# EAGLE design rcstick-f-small (EAGLE 9.5.2)
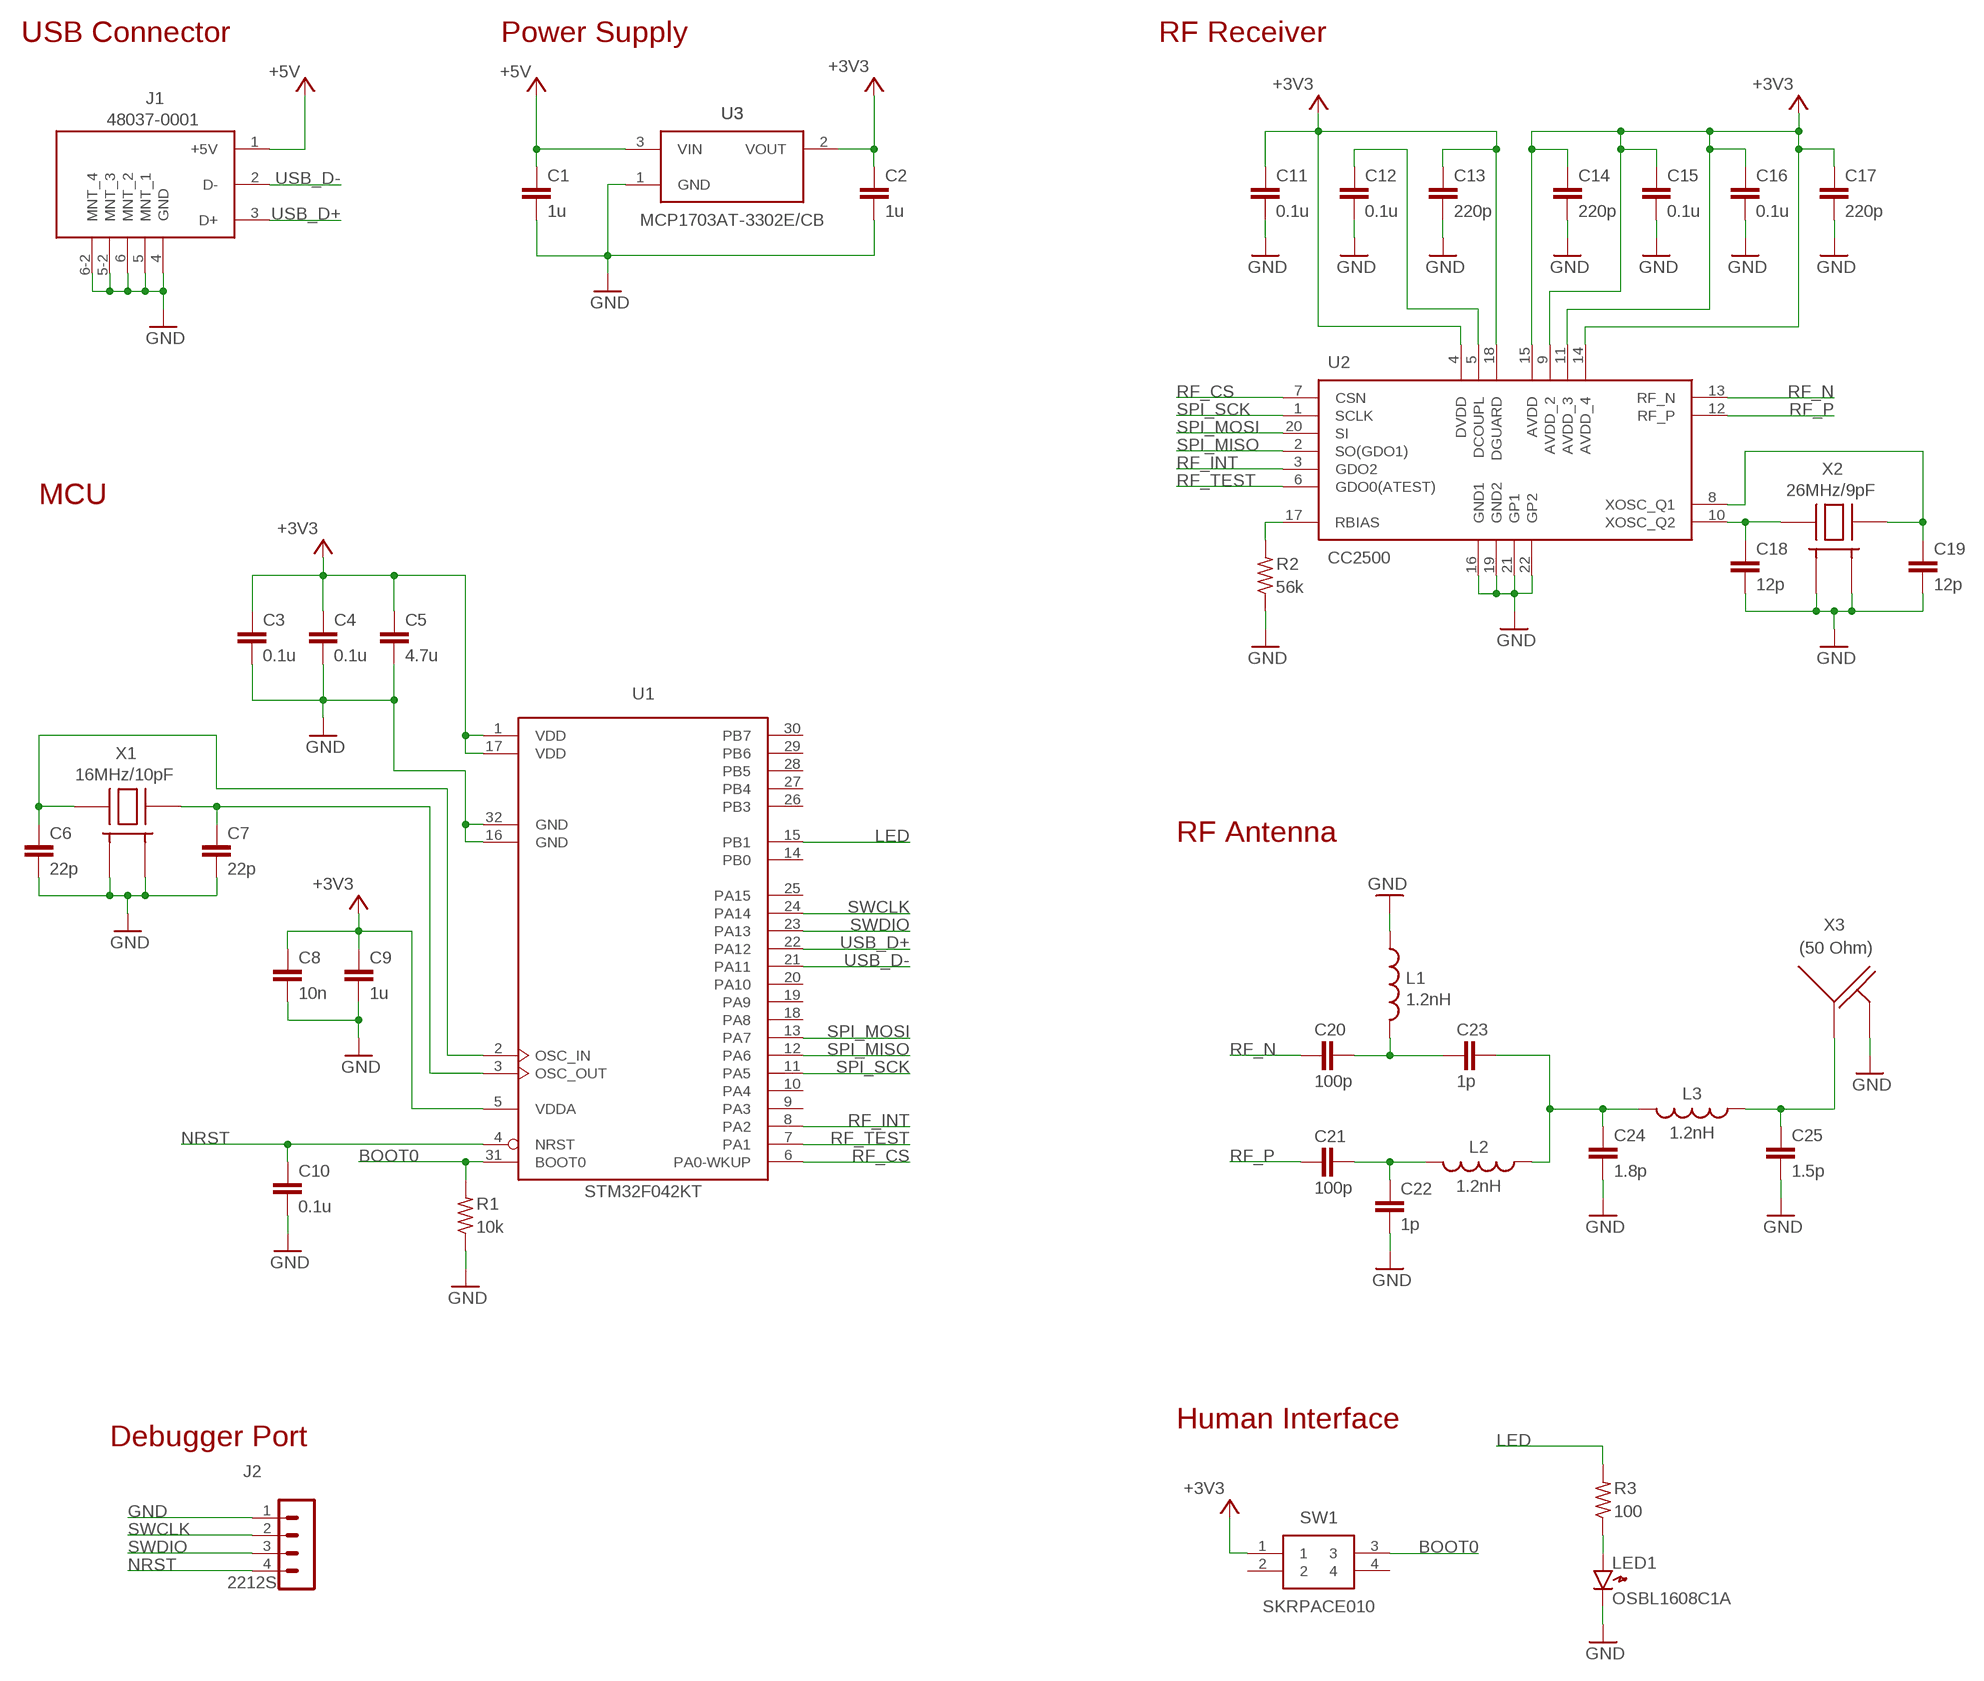
[diagram p0: schematic, sheet 1]

## Parts
C1  1u  RCL_C-EUC0402-HS  [RCL_C0402_HS]
C2  1u  RCL_C-EUC0402-HS  [RCL_C0402_HS]
C3  0.1u  RCL_C-EUC0402-HS  [RCL_C0402_HS]
C4  0.1u  RCL_C-EUC0402-HS  [RCL_C0402_HS]
C5  4.7u  RCL_C-EUC0402-HS  [RCL_C0402_HS]
C6  22p  RCL_C-EUC0402-HS  [RCL_C0402_HS]
C7  22p  RCL_C-EUC0402-HS  [RCL_C0402_HS]
C8  10n  RCL_C-EUC0402-HS  [RCL_C0402_HS]
C9  1u  RCL_C-EUC0402-HS  [RCL_C0402_HS]
C10  0.1u  RCL_C-EUC0402-HS  [RCL_C0402_HS]
C11  0.1u  RCL_C-EUC0402-HS  [RCL_C0402_HS]
C12  0.1u  RCL_C-EUC0402-HS  [RCL_C0402_HS]
C13  220p  RCL_C-EUC0402-HS  [RCL_C0402_HS]
C14  220p  RCL_C-EUC0402-HS  [RCL_C0402_HS]
C15  0.1u  RCL_C-EUC0402-HS  [RCL_C0402_HS]
C16  0.1u  RCL_C-EUC0402-HS  [RCL_C0402_HS]
C17  220p  RCL_C-EUC0402-HS  [RCL_C0402_HS]
C18  12p  RCL_C-EUC0402-HS  [RCL_C0402_HS]
C19  12p  RCL_C-EUC0402-HS  [RCL_C0402_HS]
C20  100p  RCL_C-EUC0402-HS  [RCL_C0402_HS]
C21  100p  RCL_C-EUC0402-HS  [RCL_C0402_HS]
C22  1p  RCL_C-EUC0402-HS  [RCL_C0402_HS]
C23  1p  RCL_C-EUC0402-HS  [RCL_C0402_HS]
C24  1.8p  RCL_C-EUC0402-HS  [RCL_C0402_HS]
C25  1.5p  RCL_C-EUC0402-HS  [RCL_C0402_HS]
J1  MOLEX_48037-0001  [MOLEX_48037-0001_1]
J2  2212S  53047-0410  [53047-0410]
L1  1.2nH  RCL_L-USL0402-HS  [RCL_L0402_HS]
L2  1.2nH  RCL_L-USL0402-HS  [RCL_L0402_HS]
L3  1.2nH  RCL_L-USL0402-HS  [RCL_L0402_HS]
LED1  OSBL1608C1A  LED1608  [LED1608]
R1  10k  RCL_R-US_R0402-HS  [RCL_R0402_HS]
R2  56k  RCL_R-US_R0402-HS  [RCL_R0402_HS]
R3  100  RCL_R-US_R0402-HS  [RCL_R0402_HS]
SW1  SKRPACE010  [SMT(4.2X3.2)]
U1  STM32F042KT  [LQFP32-M]
U2  CC2500  CC2500-HS  [CC2500-RTY1_CC2500-HS]
U3  MCP1703AT-3302E/CB  LDO-REGULATOR  [SOT23]
X1  16MHz/10pF  CRYSTAL3225HS  [CRYSTAL3225-HS]
X2  26MHz/9pF  CRYSTAL3225HS  [CRYSTAL3225-HS]
X3  (50 Ohm)  2.4GHZ-INVERED-FSMALL-FLIP  [2.4GHZ-INVERTED-F-SMALL-FLIP]

## Nets
+3V3 [pwr]: C2.1 C3.1 C4.1 C5.1 C8.1 C9.1 C11.1 C13.1 C14.1 C15.1 C16.1 C17.1 SW1.1 U1.1(VDD) U1.5(VDDA) U1.17(VDD) U2.4(DVDD) U2.9(AVDD_2) U2.11(AVDD_3) U2.14(AVDD_4) U2.15(AVDD) U2.18(DGUARD) U3.2(VOUT)
+5V [pwr]: C1.1 J1.1(+5V) U3.3(VIN)
BOOT0: R1.2 SW1.3 U1.31(BOOT0)
DCOUPL: C12.1 U2.5(DCOUPL)
GND [gnd]: C1.2 C2.2 C3.2 C4.2 C5.2 C6.2 C7.2 C8.2 C9.2 C10.2 C11.2 C12.2 C13.2 C14.2 C15.2 C16.2 C17.2 C18.2 C19.2 C22.2 C24.2 C25.2 J1.4(GND) J1.5(MNT_1) J1.5-2(MNT_3) J1.6(MNT_2) J1.6-2(MNT_4) J2.1 L1.1 LED1.K R1.1 R2.1 U1.16(GND) U1.32(GND) U2.16(GND1) U2.19(GND2) U2.21(GP1) U2.22(GP2) U3.1(GND) X1.2(GND_1) X1.4(GND_2) X2.2(GND_1) X2.4(GND_2) X3.2(GND)
LED: R3.2 U1.15(PB1)
N$1: LED1.A R3.1
N$5: C20.2 C23.1 L1.2
N$9: C21.2 C22.1 L2.2
N$10: C23.2 C24.1 L2.1 L3.2
N$11: C25.1 L3.1 X3.1(ANT)
NRST: C10.1 J2.4 U1.4(NRST)
OSC_IN: C6.1 U1.2(OSC_IN) X1.1(HOT_1)
OSC_OUT: C7.1 U1.3(OSC_OUT) X1.3(HOT_2)
RBIAS: R2.2 U2.17(RBIAS)
RF_CS: U1.6(PA0-WKUP) U2.7(CSN)
RF_INT: U1.8(PA2) U2.3(GDO2)
RF_N: C20.1 U2.13(RF_N)
RF_P: C21.1 U2.12(RF_P)
RF_TEST: U1.7(PA1) U2.6(GDO0(ATEST))
SPI_MISO: U1.12(PA6) U2.2(SO(GDO1))
SPI_MOSI: U1.13(PA7) U2.20(SI)
SPI_SCK: U1.11(PA5) U2.1(SCLK)
SWCLK: J2.2 U1.24(PA14)
SWDIO: J2.3 U1.23(PA13)
USB_D+: J1.3(D+) U1.22(PA12)
USB_D-: J1.2(D-) U1.21(PA11)
XOSC1: C19.1 U2.8(XOSC_Q1) X2.3(HOT_2)
XOSC2: C18.1 U2.10(XOSC_Q2) X2.1(HOT_1)
Unconnected: SW1.2 SW1.4 U1.9(PA3) U1.10(PA4) U1.14(PB0) U1.18(PA8) U1.19(PA9) U1.20(PA10) U1.25(PA15) U1.26(PB3) U1.27(PB4) U1.28(PB5) U1.29(PB6) U1.30(PB7)

## Notes on the sheet
- USB Connector | Power Supply | RF Receiver
- MCU
- RF Antenna
- Human Interface
- Debugger Port

## Library data of the parts
C1-C25 = gen-discrete3:RCL_C-EU: CAPACITOR, European symbol
J1 = Molex-48037-0001:MOLEX_48037-0001: Universal Serial Bus (USB) Shielded I/O Plug, Type A, Right Angle, Through Hole, 0.76µm Gold (Au) Plating, PCB Thickness 1.20mm-1.60mm, Lead-Free
J2 = connector:53047-0410: HEADER
L1-L3 = gen-discrete3:RCL_L-US: INDUCTOR, American symbol
LED1 = gen-discrete:LED: Generic LEDs
R1-R3 = gen-discrete3:RCL_R-US_: RESISTOR, American symbol
SW1 = SKRPACE010:SKRPACE010: Tactile Switches 4.2x3.2x2.5mm 260gf Source: Datasheet <http://www.alps.com/prod/info/E/HTML/Tact/SurfaceMount/SKRP/SKRPACE010.html>; ARROW_PART_NUMBER: SKRPACE010; DESCRIPTION: Tactile Switches 4.2x3.2x2.5mm 260gf; HEIGHT: mm; MANUFACTURER_NAME: ALPS; MANUFACTURER_PART_NUMBER: SKRPACE010
U1 = stm32:STM32F042K*T
U2 = CC2500:CC2500: RF Transceiver Source: Datasheet
U3 = SOT23_Module:LDO-REGULATOR
X1 X2 = CRYSTAL3225:CRYSTAL3225: Crystals 3225
X3 = antenna:2.4GHZ-INVERED-F

## Net classes
1 gnd: width 0.2 mm
2 pwr: width 0.2 mm

## Board
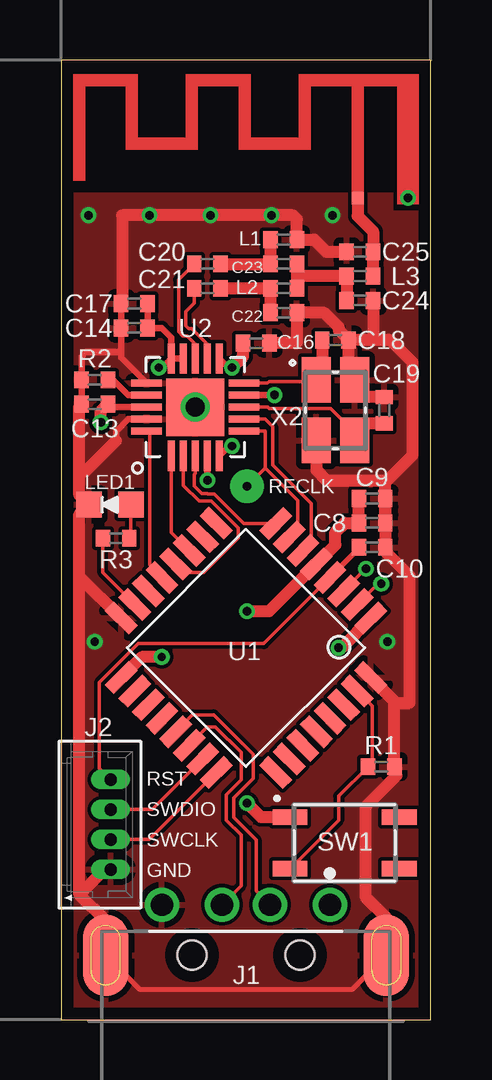
[diagram p1: board, top side]
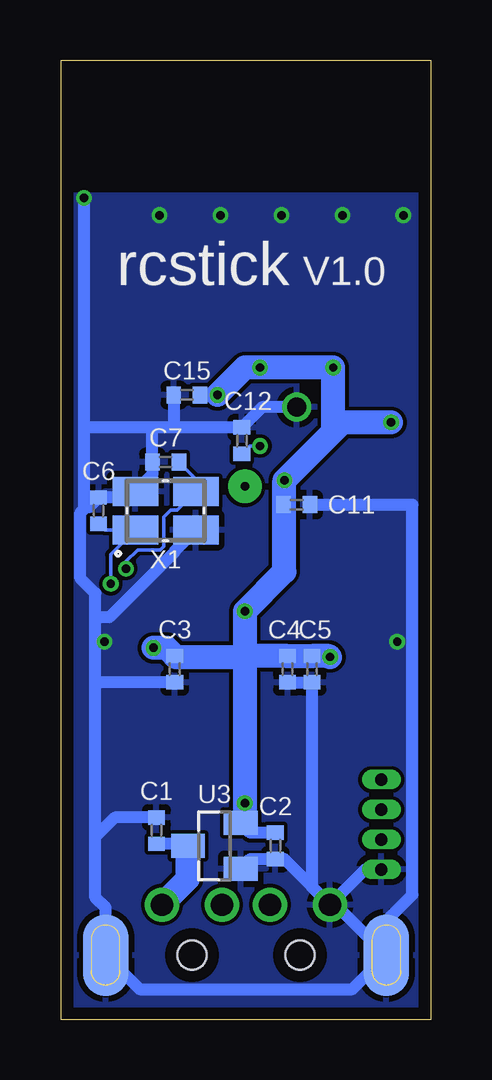
[diagram p2: board, bottom side, seen from below]

Size 15.4 x 40 mm. Coordinates in mm from the lower left corner, seen from the top.
Outline: 15.4,40 0,40 0,0 15.4,0 15.4,40
Outline: 12.95,3.33 arc-180 14.15,3.33 14.15,2.04 arc-180 12.95,2.04 12.95,3.33
Outline: 1.25,3.33 arc-180 2.45,3.33 2.45,2.04 arc-180 1.25,2.04 1.25,3.33
Copper layers (1*16): Top 0.035mm / dielectric 0.93mm / Bottom 0.035mm
Design rules "Elecrow_2-layer_PCB_eagle_rule *": minimum track width 6mil, minimum drill 12mil, track to track 6mil, track to pad 6mil, pad to pad 6mil, via to via 8mil, smd to smd 0mil, copper to edge 20mil, drill to drill 10mil, minimum pad ring 6mil, minimum via ring 6mil, stop-mask expansion 0mil, vias tented up to drill 100mil, thermal gap 10mil

### Footprints (pad centres in the part's own frame; a part is rotated, then mirrored left to right if it is on the bottom)
RCL_C0402_HS = smd 0.6 x 0.7: 1 -0.55,0; 2 0.55,0
MOLEX_48037-0001_1 = drill 0.93 pad 1.42: 1 3.5,10.5; 2 1,10.5; 3 -1,10.5; 4 -3.5,10.5 | smd 1.9 x 3.4: 5 -5.85,8.4; 6 5.85,8.4 | smd 1.9 x 3.4 bottom: 5-2 -5.85,8.4; 6-2 5.85,8.4 | hole 1.2: -2.25,8.4; 2.25,8.4
53047-0410 = drill 0.508 long: 1 1.875,0; 2 0.625,0; 3 -0.625,0; 4 -1.875,0
RCL_L0402_HS = smd 0.6 x 0.7: 1 -0.55,0; 2 0.55,0
LED1608 = smd 1.05 x 1.08: A -0.875,0; K 0.875,0
RCL_R0402_HS = smd 0.6 x 0.7: 1 -0.55,0; 2 0.55,0
SMT(4.2X3.2) = smd 1.45 x 0.65: 1 -2.275,1.075; 2 2.275,1.075; 3 -2.275,-1.075; 4 2.275,-1.075
LQFP32-M = smd 0.54 x 1.4: 1 -2.8,-4.55; 2 -2,-4.55; 3 -1.2,-4.55; 4 -0.4,-4.55; 5 0.4,-4.55; 6 1.19,-4.55; 7 1.99,-4.55; 8 2.79,-4.55; 17 2.8,4.55; 18 2,4.55; 19 1.2,4.55; 20 0.4,4.55; 21 -0.4,4.55; 22 -1.2,4.55; 23 -2,4.55; 24 -2.8,4.55 | smd 1.4 x 0.54: 9 4.55,-2.8; 10 4.55,-2; 11 4.55,-1.2; 12 4.55,-0.4; 13 4.55,0.4; 14 4.55,1.2; 15 4.55,2; 16 4.55,2.8; 25 -4.55,2.8; 26 -4.55,2; 27 -4.55,1.2; 28 -4.55,0.4; 29 -4.55,-0.4; 30 -4.55,-1.2; 31 -4.55,-2; 32 -4.55,-2.8
CC2500-RTY1_CC2500-HS = smd 1.26 x 0.28: 1 -2.03,1; 2 -2.03,0.5; 3 -2.03,0; 4 -2.03,-0.5; 5 -2.03,-1; 11 2.03,-1; 12 2.03,-0.5; 13 2.03,0; 14 2.03,0.5; 15 2.03,1 | smd 0.28 x 1.26: 6 -1,-2.03; 7 -0.5,-2.03; 8 0,-2.03; 9 0.5,-2.03; 10 1,-2.03; 16 1,2.03; 17 0.5,2.03; 18 0,2.03; 19 -0.5,2.03; 20 -1,2.03 | smd 2.4 x 2.4: 21 0,0 | drill 0.8: 22 0,0
SOT23 = smd 1 x 1.4: 1 -0.95,-1.1; 2 0.95,-1.1; 3 0,1.1
CRYSTAL3225-HS = smd 1.9 x 1.2: 1 -1.26,-0.8; 2 1.26,-0.8; 3 1.26,0.8; 4 -1.26,0.8
2.4GHZ-INVERTED-F-SMALL-FLIP = smd 0.5 x 0.5: 1 12.35,-5.45 | drill 0.35 pad 0.5: 2 14.45,-5.45

### Placement (x,y rotation side)
C1  11.43,7.87 90 bottom
C2  6.48,7.24 270 bottom
C3  10.67,14.61 270 bottom
C4  5.97,14.61 270 bottom
C5  4.95,14.61 270 bottom
C6  13.84,21.21 90 bottom
C7  11.05,23.24 180 bottom
C8  12.95,20.7 0 top
C9  12.95,21.72 0 top
C10  12.95,19.68 0 top
C11  5.59,21.46 0 bottom
C12  7.87,24.13 90 bottom
C13  1.4,25.65 180 top
C14  3.05,28.83 180 top
C15  10.16,26.04 180 bottom
C16  8.13,28.19 0 top
C17  3.05,29.84 180 top
C18  11.43,28.32 0 top
C19  13.46,25.4 90 top
C20  6.1,31.5 0 top
C21  6.1,30.48 0 top
C22  9.27,29.46 0 top
C23  9.27,31.5 0 top
C24  12.45,29.97 0 top
C25  12.45,32 180 top
J1  7.7,-5.71 0 top
J2  2.06,8.13 270 top
L1  9.27,32.51 180 top
L2  9.27,30.48 180 top
L3  12.45,30.99 180 top
LED1  2.03,21.46 180 top
R1  13.34,10.54 180 top
R2  1.4,26.67 0 top
R3  2.29,20.07 180 top
SW1  11.81,7.37 0 top
U1  7.7,15.49 135 top
U2  5.59,25.53 90 top
U3  9.02,7.24 90 bottom
X1  11.05,21.21 0 bottom
X2  11.43,25.4 270 top
X3  0,39.7 0 top

### Tracks (layer width: path | path; a pad name or v marks a point on that pad's centre or on a via)
+3V3  (via drill 0.35)
  Top 0.28: v7.11,27.18 6.97,27.18 U2.11 | v4.06,27.18 4.21,27.18 U2.15 | U2.18 2.07,25.53 C13.1 | U2.9 8.88,26.03 v8.89,26.04 | U2.15 U2.14 | U2.15 4.59,28.43 4.19,28.83 C14.1 C17.1 | U2.4 6.09,22.49 v6.1,22.48
  Top 0.5: U1.1 11.66,15.49 v11.56,15.49 | v4.19,15.11 3.36,15.11 U1.17 | v7.75,17.02 8.66,17.02 U1.5 11.43,19.79 11.43,20.32 11.81,20.7 C8.1 C9.1 | v7.75,9.02 8.32,8.44 SW1.1 | v1.65,24.89 1.65,25.36 C13.1 | v7.11,27.18 7.58,27.64 C16.1
  Bottom 0.5: C2.1 7.52,7.79 U3.2 | 7.71,15.15 7.75,15.11 | v7.75,9.02 7.75,8.36 | v8.89,26.04 C15.1 | v6.1,22.48 6.1,21.5 C11.1
  Bottom 1: 7.75,15.11 v7.75,17.02 6.1,18.67 v6.1,22.48 4.06,24.51 | 7.75,15.11 7.75,8.36 U3.2 | 4.06,24.51 v4.06,27.18 v7.11,27.18 7.75,27.18 v8.89,26.04 | v1.65,24.89 3.68,24.89 4.06,24.51 | 7.71,15.15 C4.1 C5.1 4.23,15.15 v4.19,15.11 | 7.75,15.11 10.63,15.11 C3.1 11.01,15.49 v11.56,15.49
+5V
  Bottom 0.5: U3.3 10.2,7.32 C1.1
  Bottom 1: J1.1 10.12,5.87 U3.3
BOOT0
  Top 0.152: U1.31 12.95,13.07 12.95,10.71 R1.2 11.56,9.31 11.56,8.31 SW1.3
DCOUPL  (via drill 0.35)
  Top 0.28: v7.11,23.91 7,23.91 U2.5
  Bottom 0.152: C12.1 7.55,23.91 v7.11,23.91
GND  (via drill 0.35)
  Top 0.2: J1.6 12.13,1.27 3.27,1.27 J1.5
  Top 0.28: U2.16 2.5,27.59 2.5,27.94 | 2.5,27.94 C14.2 C17.2 | 2.5,27.94 2.37,27.81 1.02,27.81 0.85,27.64 R2.1 C13.2 | U2.19 2.8,25.03 2.29,24.51 2.29,24.13
  Top 0.5: C9.2 C10.2 13.5,19.52 14.52,18.5 14.52,13.21 13.95,13.21 | J1.6 13.55,4.23 12.7,5.08 12.7,8.89 13.97,10.16 13.97,10.46 R1.1 13.88,13.27 U1.32 | J1.5 1.85,4.12 0.76,5.21 | 0.76,5.21 0.76,18.47 | C9.2 13.5,22.39 13.59,22.48 | 13.59,22.48 14.64,23.53 14.64,27.39 13.72,28.32 12.95,28.32 | 12.95,28.32 C18.2 | C18.2 11.98,26.91 X2.4 12.23,26.04 12.32,25.95 C19.2 | 0.76,18.47 U1.16 | X2.2 10.63,22.9 11.05,22.48 13.59,22.48 | C18.2 11.58,28.72 11.58,28.84 10.96,29.46 C22.2 9.82,28.24 9.78,28.19 C16.2 | C24.2 13,28.36 12.95,28.32 | C17.2 2.54,29.89 2.54,33.53 9.65,33.53 9.82,33.36 L1.1 10.54,32.51 11.05,32 C25.2 | J2.1 1.81,6.25 0.76,5.21 | 0.76,22.86 0.76,25.57 C13.2 | C8.2 C9.2 | 0.76,22.86 1.02,22.86 2.29,24.13 | 0.76,18.47 0.76,21.07 LED1.K 0.76,21.86 0.76,22.86
  Bottom 0.5: J1.5 3.27,1.27 12.13,1.27 J1.6 13.55,4.66 13.97,5.08 13.97,7.62 | J1.5 3.95,4.79 J1.4 | J1.4 2.73,6.25 J2.1 | J1.4 4.98,5.56 | 4.98,5.56 6.1,6.69 C2.2 7.52,6.69 U3.1 | C1.2 13.17,8.42 13.97,7.62 | J1.5 1.85,4.12 0.76,5.21 0.76,21.46 C11.2 | 13.97,7.62 13.97,13.97 | 13.97,13.97 13.97,16.76 | 13.97,16.76 13.97,17.76 14.6,18.39 14.6,21.13 14.45,21.27 | 14.45,21.27 14.36,21.36 14.24,21.36 C6.2 12.56,21.76 X1.4 11.6,22.72 C7.2 11.6,24.64 11.56,24.68 | C3.2 13.88,14.05 13.97,13.97 | C4.2 C5.2 4.95,5.59 4.98,5.56 | X3.2 14.45,24.77 | 14.45,24.77 14.45,21.27 | U2.22 7.03,25.53 C12.2 10.67,24.68 | 10.67,24.68 11.56,24.68 | 11.56,24.68 14.37,24.68 14.45,24.77 | C15.2 10.71,24.72 10.67,24.68 | X1.2 10.65,19.55 10.65,19.52 13.4,16.76 13.97,16.76
  other vias: 1.14,33.53 3.68,33.53 6.22,33.53 8.76,33.53 11.3,33.53 1.4,15.75 13.59,15.75
  pour Bottom: -0.51,34.54 16,34.54 16.13,34.42 16.13,-0.38 -0.51,-0.38
  pour Top: 0.13,34.42 15.49,34.42 15.49,-0.13 0,-0.13 0,33.02 0,34.29
LED
  Top 0.152: U1.15 1.74,18.63 R3.2
N$1
  Top 0.152: R3.1 2.91,20.14 LED1.A
N$5
  Top 0.5: C20.2 C23.1 L1.2
N$9
  Top 0.5: C21.2 L2.2 C22.1
N$10
  Top 0.5: C23.2 9.82,30.99 | 9.82,30.99 L2.1 | 9.82,30.99 L3.2 C24.1
N$11
  Top 0.5: L3.1 C25.1 13,32.85 12.35,33.5 X3.1
NRST
  Top 0.152: U1.4 8.44,15.67 3.21,15.67 1.59,14.05 1.59,10.48 J2.4
  Top 0.2: U1.4 12.4,19.63 C10.1
OSC_IN  (via drill 0.35)
  Top 0.152: v13.34,18.16 13.2,18.16 U1.2
  Bottom 0.152: C6.1 13.59,20.41 X1.1 13.34,19.38 v13.34,18.16
OSC_OUT  (via drill 0.35)
  Top 0.152: v12.7,18.8 U1.3
  Bottom 0.152: C7.1 9.79,22.53 X1.3 10.56,21.24 10.83,21.24 11.13,20.94 11.13,19.71 11.26,19.58 12.22,19.58 12.7,19.1 v12.7,18.8
RBIAS
  Top 0.28: U2.17 2.8,26.03 2.16,26.67 R2.2
RF_CS
  Top 0.152: U1.6 10.43,19.9 10.43,21.5 8.81,23.11 8.81,24.71 8.5,25.03 U2.7
RF_INT
  Top 0.152: U2.3 5.59,22.76 5.54,22.71 5.54,22.25 5.87,21.92 6.1,21.92 6.11,21.91 6.38,21.91 7.61,20.68 U1.8
RF_N
  Top 0.152: C20.1 4.89,30.84 4.89,28.67 5.07,28.49 5.25,28.49 5.59,28.15 U2.13
RF_P
  Top 0.152: C21.1 5.55,29.87 5.19,29.52 5.19,28.92 5.32,28.8 5.44,28.8 6.09,28.15 U2.12
RF_TEST  (via drill 0.35 pad 1.4)
  Top 0.152: U2.6 8.49,24.53 8.51,24.51 8.51,22.99 | 8.51,22.99 9.86,21.64 9.86,20.47 U1.7 | v7.75,22.23 8.51,22.99
SPI_MISO
  Top 0.152: U2.2 5.09,22.27 5.75,21.61 6.25,21.61 7.38,20.48 7.38,20.08 5.95,18.64 5.11,18.64 U1.12
SPI_MOSI
  Top 0.152: U1.13 3.68,18.95 3.68,24.4 U2.20
SPI_SCK
  Top 0.152: U2.1 4.59,20.3 U1.11
SWCLK
  Top 0.152: U1.24 3.67,7.5 J2.2
SWDIO
  Top 0.152: U1.23 3.79,8.75 J2.3
USB_D+
  Top 0.152: U1.22 6.09,12.19 6.43,12.19 7.49,11.13 7.49,9.98 6.89,9.37 6.89,8.3 7.49,7.7 7.49,5.58 J1.3
USB_D-
  Top 0.152: U1.21 5.47,12.7 6.35,12.7 8,11.05 8,10.06 7.19,9.25 7.19,8.43 8.13,7.49 8.13,5.36 J1.2
XOSC1
  Top 0.152: X2.3 12.23,24.47 11.22,25.48 8.66,25.48 8.61,25.53 U2.8
  Top 0.5: C19.1 12.4,24.85 12.32,24.77 12.32,24.23 X2.3
XOSC2
  Top 0.152: U2.10 8.6,26.53 8.66,26.59 10.56,26.59 X2.1
  Top 0.5: C18.1 10.88,26.91 X2.1

### Text on the board
bPlace: V1.0 | rcstick
tNames: LED1 | RFCLK | RST | SWDIO | SWCLK | GND